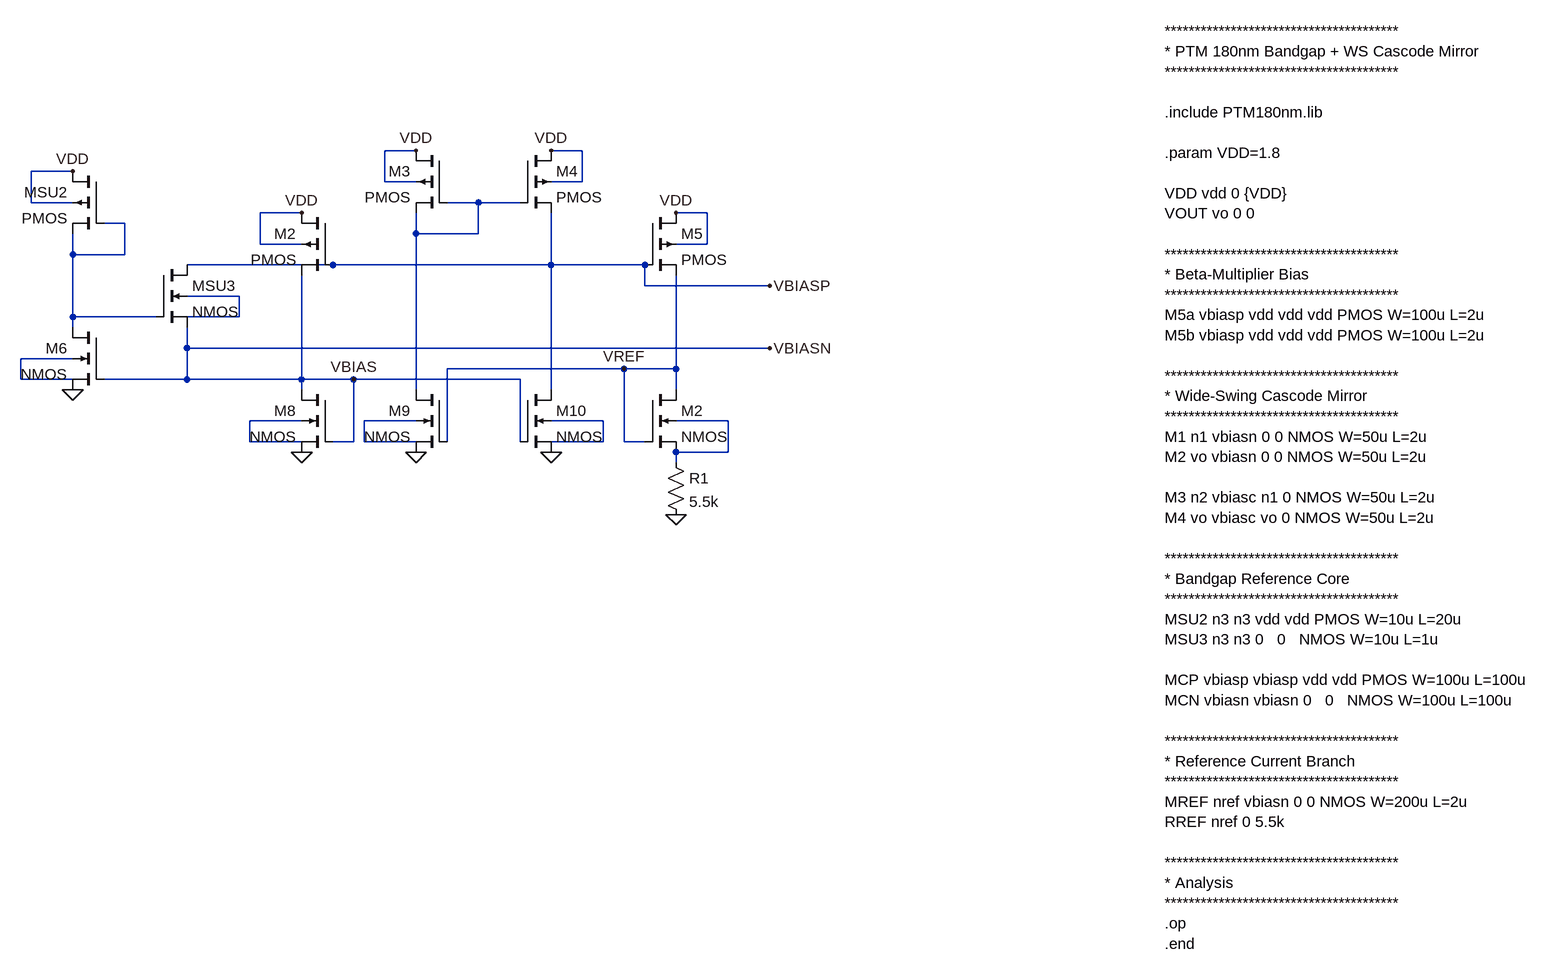
[diagram p0: schematic Draft1.asc]
Draft1.asc, the LTspice schematic file:
Version 4.1
SHEET 1 880 1300
WIRE -1264 208 -1312 208
WIRE -1008 208 -1056 208
WIRE -1792 240 -1856 240
WIRE -1312 256 -1312 208
WIRE -1264 256 -1312 256
WIRE -1008 256 -1008 208
WIRE -1008 256 -1056 256
WIRE -1856 288 -1856 240
WIRE -1792 288 -1856 288
WIRE -1168 288 -1216 288
WIRE -1104 288 -1168 288
WIRE -1440 304 -1504 304
WIRE -816 304 -864 304
WIRE -1712 320 -1744 320
WIRE -1264 336 -1264 304
WIRE -1168 336 -1168 288
WIRE -1168 336 -1264 336
WIRE -1504 352 -1504 304
WIRE -1440 352 -1504 352
WIRE -816 352 -816 304
WIRE -816 352 -864 352
WIRE -1792 368 -1792 336
WIRE -1712 368 -1712 320
WIRE -1712 368 -1792 368
WIRE -1392 384 -1616 384
WIRE -1056 384 -1056 304
WIRE -1056 384 -1392 384
WIRE -912 384 -1056 384
WIRE -912 416 -912 384
WIRE -720 416 -912 416
WIRE -1536 432 -1616 432
WIRE -1792 464 -1792 368
WIRE -1664 464 -1792 464
WIRE -1536 464 -1536 432
WIRE -1536 464 -1616 464
WIRE -1792 480 -1792 464
WIRE -1616 512 -1616 480
WIRE -720 512 -1616 512
WIRE -1792 528 -1872 528
WIRE -944 544 -1216 544
WIRE -864 544 -864 400
WIRE -864 544 -944 544
WIRE -1872 560 -1872 528
WIRE -1792 560 -1872 560
WIRE -1616 560 -1616 512
WIRE -1616 560 -1744 560
WIRE -1440 560 -1440 400
WIRE -1440 560 -1616 560
WIRE -1360 560 -1440 560
WIRE -1104 560 -1360 560
WIRE -1440 576 -1440 560
WIRE -1264 576 -1264 336
WIRE -1056 576 -1056 384
WIRE -864 576 -864 544
WIRE -1440 624 -1520 624
WIRE -1264 624 -1344 624
WIRE -976 624 -1056 624
WIRE -784 624 -864 624
WIRE -1520 656 -1520 624
WIRE -1440 656 -1520 656
WIRE -1360 656 -1360 560
WIRE -1360 656 -1392 656
WIRE -1344 656 -1344 624
WIRE -1264 656 -1344 656
WIRE -1216 656 -1216 544
WIRE -1104 656 -1104 560
WIRE -976 656 -976 624
WIRE -976 656 -1056 656
WIRE -944 656 -944 544
WIRE -912 656 -944 656
WIRE -784 672 -784 624
WIRE -784 672 -864 672
WIRE -864 688 -864 672
FLAG -1056 672 0
FLAG -1264 672 0
FLAG -1440 672 0
FLAG -1792 576 0
FLAG -864 768 0
FLAG -1792 240 VDD
FLAG -1440 304 VDD
FLAG -1264 208 VDD
FLAG -1056 208 VDD
FLAG -864 304 VDD
FLAG -1360 560 VBIAS
FLAG -944 544 VREF
FLAG -720 416 VBIASP
FLAG -720 512 VBIASN
SYMBOL pmos4 -1744 240 M0
SYMATTR InstName MSU2
SYMATTR Value2 l=20 w=10
SYMBOL pmos4 -1392 304 M0
SYMATTR InstName M2
SYMATTR Value2 l=2 w=100
SYMBOL pmos4 -1216 208 M0
SYMATTR InstName M3
SYMATTR Value2 l=2 w=100
SYMBOL pmos4 -1104 208 R0
SYMATTR InstName M4
SYMATTR Value2 l=2 w=100
SYMBOL pmos4 -912 304 R0
SYMATTR InstName M5
SYMATTR Value2 l=2 w=100
SYMBOL nmos4 -1744 480 M0
SYMATTR InstName M6
SYMATTR Value2 l=2 w=50
SYMBOL nmos4 -1664 384 R0
SYMATTR InstName MSU3
SYMATTR Value2 l=1 w=10
SYMBOL nmos4 -1392 576 M0
SYMATTR InstName M8
SYMATTR Value2 l=2 w=50
SYMBOL nmos4 -1216 576 M0
SYMATTR InstName M9
SYMATTR Value2 l=2 w=50
SYMBOL nmos4 -1104 576 R0
SYMATTR InstName M10
SYMATTR Value2 l=2 w=50
SYMBOL nmos4 -912 576 R0
SYMATTR InstName M2
SYMATTR Value2 l=2 w=200
SYMBOL res -880 672 R0
SYMATTR InstName R1
SYMATTR Value 5.5k
TEXT -112 24 Left 2 !***************************************\n* PTM 180nm Bandgap + WS Cascode Mirror\n***************************************\n \n.include PTM180nm.lib\n \n.param VDD=1.8\n \nVDD vdd 0 {VDD}\nVOUT vo 0 0\n \n***************************************\n* Beta-Multiplier Bias\n***************************************\nM5a vbiasp vdd vdd vdd PMOS W=100u L=2u\nM5b vbiasp vdd vdd vdd PMOS W=100u L=2u\n \n***************************************\n* Wide-Swing Cascode Mirror\n***************************************\nM1 n1 vbiasn 0 0 NMOS W=50u L=2u\nM2 vo vbiasn 0 0 NMOS W=50u L=2u\n \nM3 n2 vbiasc n1 0 NMOS W=50u L=2u\nM4 vo vbiasc vo 0 NMOS W=50u L=2u\n \n***************************************\n* Bandgap Reference Core\n***************************************\nMSU2 n3 n3 vdd vdd PMOS W=10u L=20u\nMSU3 n3 n3 0   0   NMOS W=10u L=1u\n \nMCP vbiasp vbiasp vdd vdd PMOS W=100u L=100u\nMCN vbiasn vbiasn 0   0   NMOS W=100u L=100u\n \n***************************************\n* Reference Current Branch\n***************************************\nMREF nref vbiasn 0 0 NMOS W=200u L=2u\nRREF nref 0 5.5k\n \n***************************************\n* Analysis\n***************************************\n.op\n.end

The netlist it stands for:
* Draft1.asc
MSU2 VDD N002 N002 VDD PMOS l=20 w=10
M2 VDD VBIASP VBIASN VDD PMOS l=2 w=100
M3 VDD N001 N001 VDD PMOS l=2 w=100
M4 VDD N001 VBIASP VDD PMOS l=2 w=100
M5 VDD VBIASP VREF VDD PMOS l=2 w=100
M6 N002 VBIASN 0 N004 NMOS l=2 w=50
MSU3 VBIASP N002 VBIASN N003 NMOS l=1 w=10
M8 VBIASN VBIASN 0 N005 NMOS l=2 w=50
M9 N001 VREF 0 N006 NMOS l=2 w=50
M10 VBIASP VBIASN 0 N007 NMOS l=2 w=50
M2 VREF VREF N008 N008 NMOS l=2 w=200
R1 N008 0 5.5k
.model NMOS NMOS
.model PMOS PMOS
.lib standard.mos
***************************************
* PTM 180nm Bandgap + WS Cascode Mirror
***************************************
.include PTM180nm.lib
.param VDD=1.8
VDD vdd 0 {VDD}
VOUT vo 0 0
***************************************
* Beta-Multiplier Bias
***************************************
M5a vbiasp vdd vdd vdd PMOS W=100u L=2u
M5b vbiasp vdd vdd vdd PMOS W=100u L=2u
***************************************
* Wide-Swing Cascode Mirror
***************************************
M1 n1 vbiasn 0 0 NMOS W=50u L=2u
M2 vo vbiasn 0 0 NMOS W=50u L=2u
M3 n2 vbiasc n1 0 NMOS W=50u L=2u
M4 vo vbiasc vo 0 NMOS W=50u L=2u
***************************************
* Bandgap Reference Core
***************************************
MSU2 n3 n3 vdd vdd PMOS W=10u L=20u
MSU3 n3 n3 0   0   NMOS W=10u L=1u
MCP vbiasp vbiasp vdd vdd PMOS W=100u L=100u
MCN vbiasn vbiasn 0   0   NMOS W=100u L=100u
***************************************
* Reference Current Branch
***************************************
MREF nref vbiasn 0 0 NMOS W=200u L=2u
RREF nref 0 5.5k
***************************************
* Analysis
***************************************
.op
.end
.backanno
.end